# EAGLE schematic mainboard_v1 (EAGLE 9.2.1)
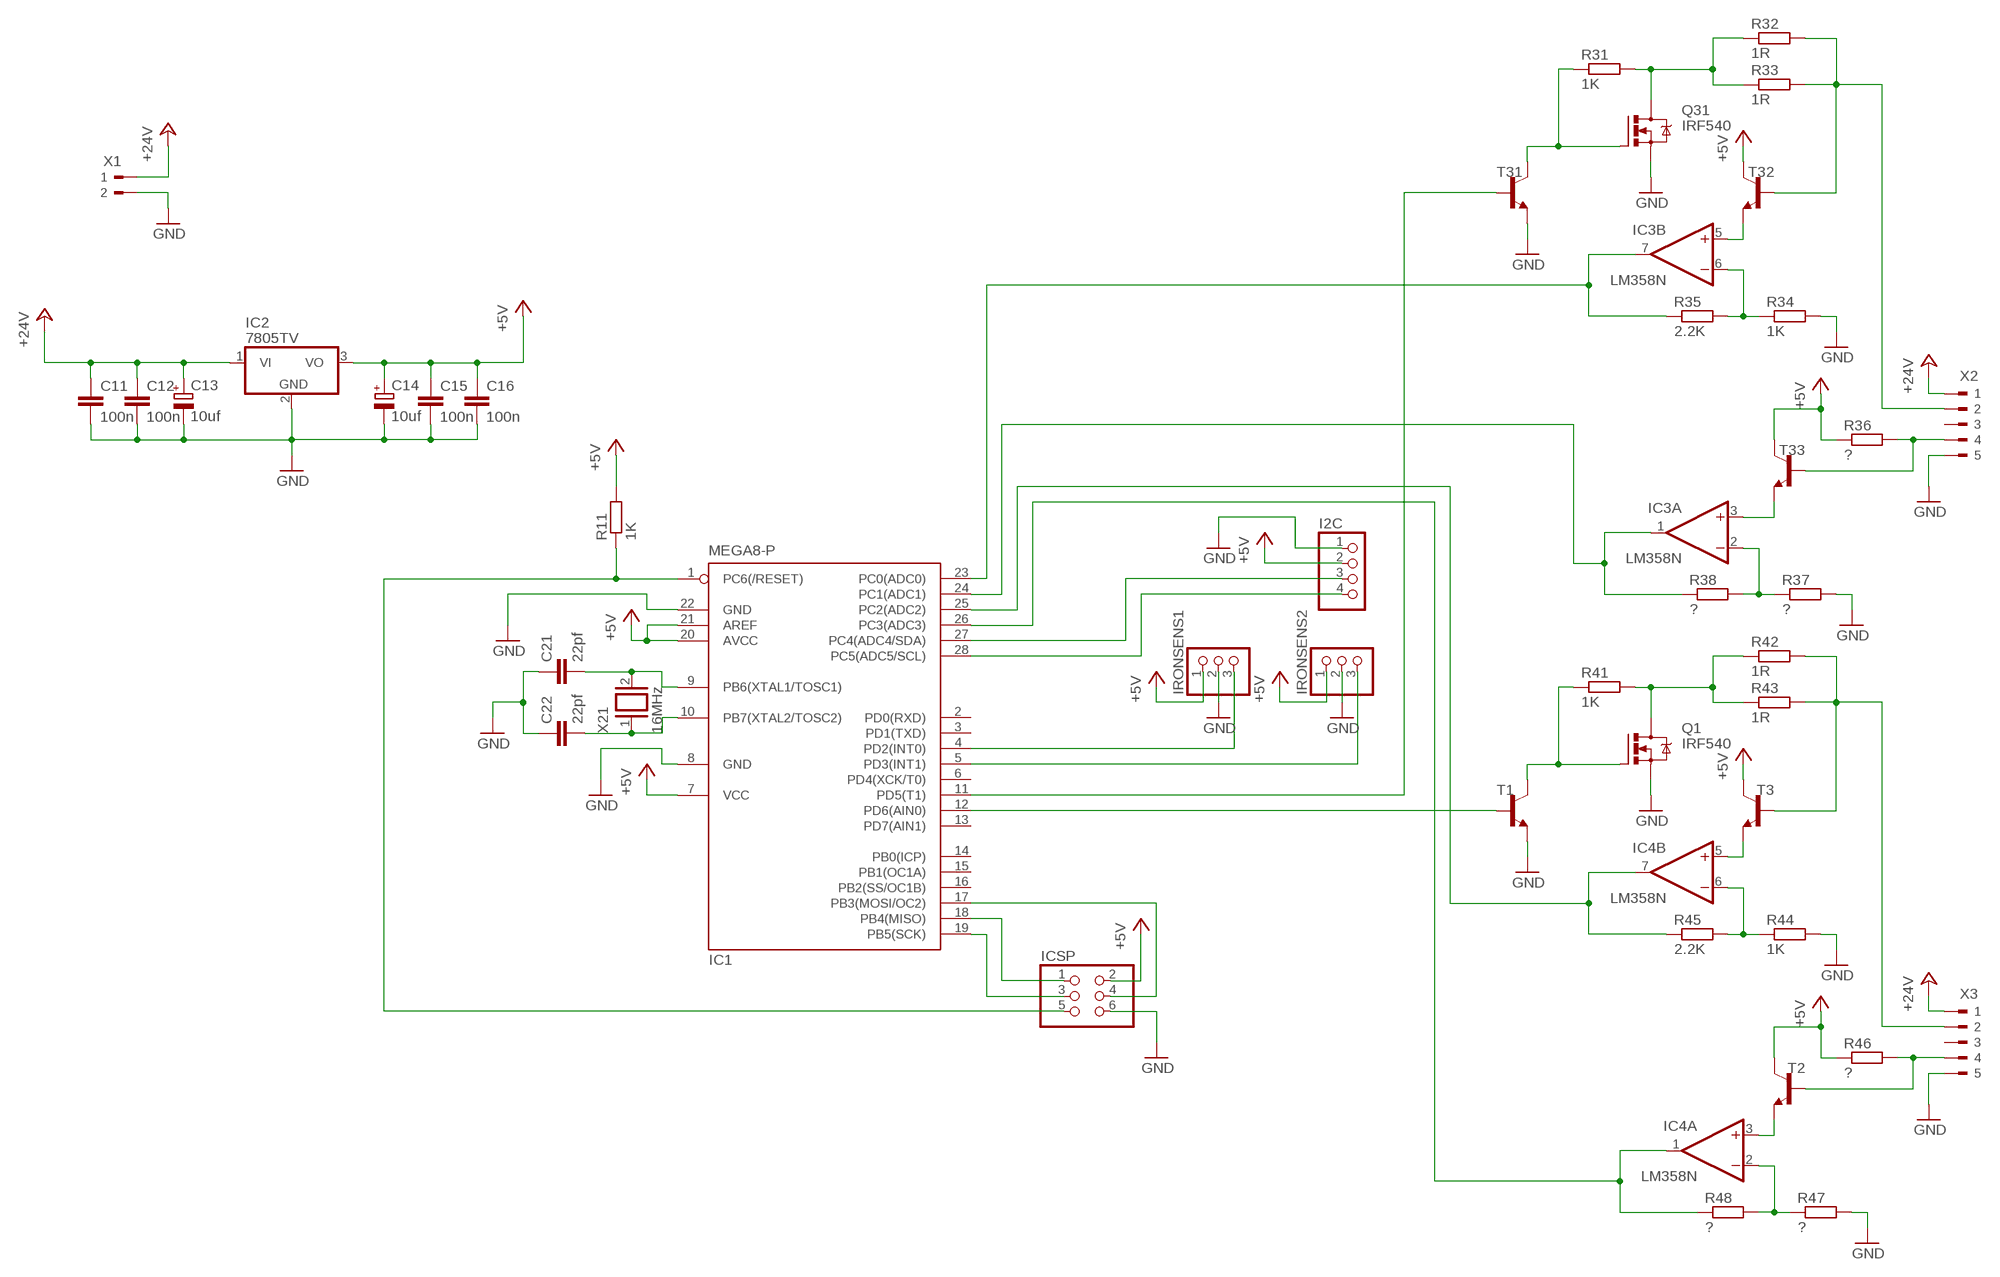
[diagram p0: schematic, sheet 1]

## Parts
C11  100n  C-EU050-030X075  [C050-030X075]
C12  100n  C-EU025-024X044  [C025-024X044]
C13  10uf  CPOL-EUE2,5-6E  [E2,5-6E]
C14  10uf  CPOL-EUE2,5-6E  [E2,5-6E]
C15  100n  C-EU025-024X044  [C025-024X044]
C16  100n  C-EU050-030X075  [C050-030X075]
C21  22pf  C-EU025-025X050  [C025-025X050]
C22  22pf  C-EU025-025X050  [C025-025X050]
I2C  PINHD-1X4  [1X04]
IC1  MEGA8-P  [DIL28-3]
IC2  7805TV  [TO220V]
IC3  LM358N  [DIL08]
IC4  LM358N  [DIL08]
ICSP  PINHD-2X3  [2X03]
IRONSENS1  PINHD-1X3  [1X03]
IRONSENS2  PINHD-1X3  [1X03]
Q1  IRF540  [TO220BV]
Q31  IRF540  [TO220BV]
R11  1K  R-EU_0204/7  [0204/7]
R31  1K  R-EU_0204/7  [0204/7]
R32  1R  R-EU_R2512  [R2512]
R33  1R  R-EU_0204/7  [0204/7]
R34  1K  R-EU_0204/7  [0204/7]
R35  2.2K  R-EU_0204/7  [0204/7]
R36  ?  R-EU_0204/7  [0204/7]
R37  ?  R-EU_0204/7  [0204/7]
R38  ?  R-EU_0204/7  [0204/7]
R41  1K  R-EU_0204/7  [0204/7]
R42  1R  R-EU_R2512  [R2512]
R43  1R  R-EU_0204/7  [0204/7]
R44  1K  R-EU_0204/7  [0204/7]
R45  2.2K  R-EU_0204/7  [0204/7]
R46  ?  R-EU_0204/7  [0204/7]
R47  ?  R-EU_0204/7  [0204/7]
R48  ?  R-EU_0204/7  [0204/7]
T1  BC548-NPN-TO92-CBE  [TO92-CBE]
T2  BC548-NPN-TO92-CBE  [TO92-CBE]
T3  BC548-NPN-TO92-CBE  [TO92-CBE]
T31  BC548-NPN-TO92-CBE  [TO92-CBE]
T32  BC548-NPN-TO92-CBE  [TO92-CBE]
T33  BC548-NPN-TO92-CBE  [TO92-CBE]
X1  180-2  [180-2]
X2  180-5  [180-5]
X3  180-5  [180-5]
X21  16MHz  XTAL/S  [QS]

## Nets
+5V: C14.+ C15.1 C16.1 I2C.2 IC1.7(VCC) IC1.20(AVCC) IC1.21(AREF) IC2.3(VO) ICSP.2 IRONSENS1.1 IRONSENS2.1 R11.2 R36.1 R46.1 T2.C T3.C T32.C T33.C
+24V: C11.1 C12.1 C13.+ IC2.1(VI) X1.1 X2.1 X3.1
GND: C11.2 C12.2 C13.- C14.- C15.2 C16.2 C21.1 C22.1 I2C.1 IC1.8(GND) IC1.22(GND) IC2.2(GND) ICSP.6 IRONSENS1.2 IRONSENS2.2 Q1.S Q31.S R34.2 R37.2 R44.2 R47.2 T1.E T31.E X1.2 X2.5 X3.5
N$1: R36.2 T33.B X2.4
N$2: IC3.3(A:+IN) T33.E
N$3: Q31.D R31.2 R32.1 R33.1
N$4: IC4.3(A:+IN) T2.E
N$5: IC4.2(A:-IN) R47.1 R48.2
N$6: Q31.G R31.1 T31.C
N$7: IC1.18(PB4(MISO)) ICSP.1
N$8: IC1.25(PC2(ADC2)) IC4.7(B:OUT) R45.1
N$9: IC3.2(A:-IN) R37.1 R38.2
N$10: Q1.D R41.2 R42.1 R43.1
N$12: Q1.G R41.1 T1.C
N$13: IC1.11(PD5(T1)) T31.B
N$14: IC1.12(PD6(AIN0)) T1.B
N$15: IC1.4(PD2(INT0)) IRONSENS1.3
N$16: IC1.5(PD3(INT1)) IRONSENS2.3
N$17: IC1.24(PC1(ADC1)) IC3.1(A:OUT) R38.1
N$18: IC1.19(PB5(SCK)) ICSP.3
N$19: IC1.1(PC6(/RESET)) ICSP.5 R11.1
N$20: IC1.17(PB3(MOSI/OC2)) ICSP.4
N$21: C21.2 IC1.9(PB6(XTAL1/TOSC1)) X21.2
N$22: C22.2 IC1.10(PB7(XTAL2/TOSC2)) X21.1
N$24: I2C.4 IC1.28(PC5(ADC5/SCL))
N$25: I2C.3 IC1.27(PC4(ADC4/SDA))
N$26: R32.2 R33.2 T32.B X2.2
N$27: IC3.5(B:+IN) T32.E
N$28: IC3.6(B:-IN) R34.1 R35.2
N$29: R42.2 R43.2 T3.B X3.2
N$30: IC1.23(PC0(ADC0)) IC3.7(B:OUT) R35.1
N$31: R46.2 T2.B X3.4
N$32: IC4.5(B:+IN) T3.E
N$33: IC4.6(B:-IN) R44.1 R45.2
N$35: IC1.26(PC3(ADC3)) IC4.1(A:OUT) R48.1
Unconnected: IC1.2(PD0(RXD)) IC1.3(PD1(TXD)) IC1.6(PD4(XCK/T0)) IC1.13(PD7(AIN1)) IC1.14(PB0(ICP)) IC1.15(PB1(OC1A)) IC1.16(PB2(SS/OC1B)) X2.3 X3.3

## Power pins joined to a net without a drawn wire
V+: IC3.8(P:V+) IC4.8(P:V+)
V-: IC3.4(P:V-) IC4.4(P:V-)

## Library data of the parts
C11 C12 C15 C16 C21 C22 = rcl:C-EU: CAPACITOR, European symbol; SPICEPREFIX: C
C13 C14 = rcl:CPOL-EU: POLARIZED CAPACITOR, European symbol; SPICEPREFIX: C
I2C = pinhead:PINHD-1X4: PIN HEADER
IC1 = atmel:MEGA8-P: MICROCONTROLLER 8 Kbytes FLASH, 1 kbytes SRAM, 512 bytes EEPROM, USART, 4-channel 10 bit ADC, 2-channel 8 bit ADC Pin compatible with Atmega48, ATMega88, ATMega168 Source: avr.lbr; OC_FARNELL: unknown; OC_NEWARK: unknown
IC2 = linear:78*: Positive VOLTAGE REGULATOR Source: http://cache.national.com/ds/LM/LM78L05.pdf http://www.fairchildsemi.com/ds/LM/LM7805.pdf
IC3 IC4 = linear:LM358: OP AMP also LM158; LM258; LM2904 Source: http://cache.national.com/ds/LM/LM158.pdf
ICSP = pinhead:PINHD-2X3: PIN HEADER
IRONSENS1 IRONSENS2 = pinhead:PINHD-1X3: PIN HEADER
Q1 Q31 = transistor-power:IRF540: HEXFET Power MOSFET
R11 R31-R38 R41-R48 = rcl:R-EU_: RESISTOR, European symbol; SPICEPREFIX: R
T1-T3 T31-T33 = transistor:*-NPN-: NPN Transistror BF959 corrected 2008.03.06
X1 = con-weidmueller-sl35:180-2: WEIDMUELLER CLAMP CONNECTOR; OC_FARNELL: unknown; OC_NEWARK: unknown
X2 X3 = con-weidmueller-sl35:180-5: WEIDMUELLER CLAMP CONNECTOR; OC_FARNELL: unknown; OC_NEWARK: unknown
X21 = special:XTAL/S: CRYSTAL